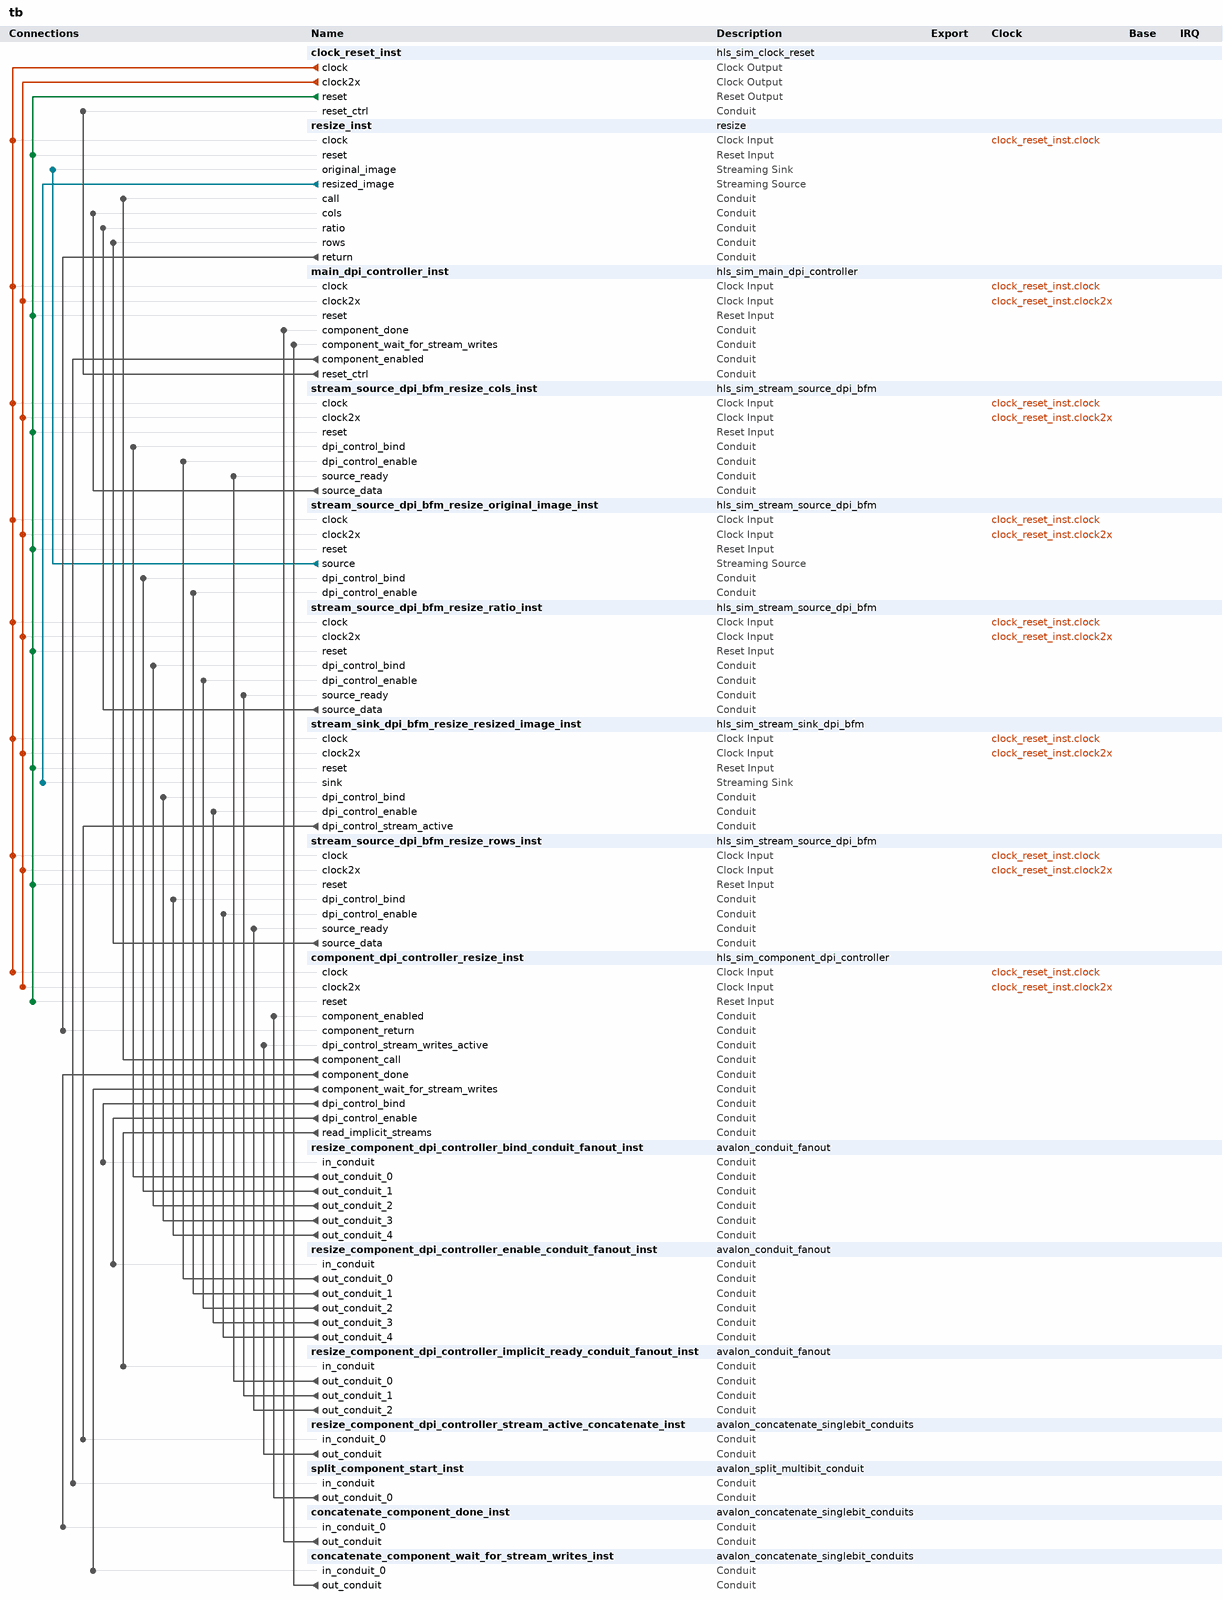
[diagram p0: system contents]
# Platform Designer (Qsys) system tb, Cyclone V 5CGXFC3B6F23C6
# Parameters at their usual value, and those the tool derives, are not listed.
package require qsys
create_system tb
set_project_property DEVICE_FAMILY {Cyclone V}
set_project_property DEVICE 5CGXFC3B6F23C6

add_instance clock_reset_inst hls_sim_clock_reset 1.0
set_instance_parameter_value clock_reset_inst RESET_CYCLE_HOLD 4

add_instance resize_inst resize 1.0

add_instance main_dpi_controller_inst hls_sim_main_dpi_controller 1.0
set_instance_parameter_value main_dpi_controller_inst COMPONENT_NAMES_STR resize
set_instance_parameter_value main_dpi_controller_inst NUM_COMPONENTS 1
set_instance_parameter_value main_dpi_controller_inst SIM_COMPONENT_CALL_COUNT_LOG_FILE .

add_instance stream_source_dpi_bfm_resize_cols_inst hls_sim_stream_source_dpi_bfm 1.0
set_instance_parameter_value stream_source_dpi_bfm_resize_cols_inst COMPONENT_NAME resize
set_instance_parameter_value stream_source_dpi_bfm_resize_cols_inst FORCE_STREAM_CONDUIT 1
set_instance_parameter_value stream_source_dpi_bfm_resize_cols_inst INTERFACE_NAME cols
set_instance_parameter_value stream_source_dpi_bfm_resize_cols_inst STREAM_BITSPERSYMBOL 1
set_instance_parameter_value stream_source_dpi_bfm_resize_cols_inst STREAM_DATAWIDTH 32
set_instance_parameter_value stream_source_dpi_bfm_resize_cols_inst USES_PACKETS 0

add_instance stream_source_dpi_bfm_resize_original_image_inst hls_sim_stream_source_dpi_bfm 1.0
set_instance_parameter_value stream_source_dpi_bfm_resize_original_image_inst COMPONENT_NAME resize
set_instance_parameter_value stream_source_dpi_bfm_resize_original_image_inst FORCE_STREAM_CONDUIT 0
set_instance_parameter_value stream_source_dpi_bfm_resize_original_image_inst INTERFACE_NAME original_image
set_instance_parameter_value stream_source_dpi_bfm_resize_original_image_inst STREAM_BITSPERSYMBOL 32
set_instance_parameter_value stream_source_dpi_bfm_resize_original_image_inst STREAM_DATAWIDTH 32
set_instance_parameter_value stream_source_dpi_bfm_resize_original_image_inst USES_PACKETS 0

add_instance stream_source_dpi_bfm_resize_ratio_inst hls_sim_stream_source_dpi_bfm 1.0
set_instance_parameter_value stream_source_dpi_bfm_resize_ratio_inst COMPONENT_NAME resize
set_instance_parameter_value stream_source_dpi_bfm_resize_ratio_inst FORCE_STREAM_CONDUIT 1
set_instance_parameter_value stream_source_dpi_bfm_resize_ratio_inst INTERFACE_NAME ratio
set_instance_parameter_value stream_source_dpi_bfm_resize_ratio_inst STREAM_BITSPERSYMBOL 1
set_instance_parameter_value stream_source_dpi_bfm_resize_ratio_inst STREAM_DATAWIDTH 32
set_instance_parameter_value stream_source_dpi_bfm_resize_ratio_inst USES_PACKETS 0

add_instance stream_sink_dpi_bfm_resize_resized_image_inst hls_sim_stream_sink_dpi_bfm 1.0
set_instance_parameter_value stream_sink_dpi_bfm_resize_resized_image_inst COMPONENT_NAME resize
set_instance_parameter_value stream_sink_dpi_bfm_resize_resized_image_inst INTERFACE_NAME resized_image
set_instance_parameter_value stream_sink_dpi_bfm_resize_resized_image_inst READY_LATENCY 0
set_instance_parameter_value stream_sink_dpi_bfm_resize_resized_image_inst STREAM_BITSPERSYMBOL 32
set_instance_parameter_value stream_sink_dpi_bfm_resize_resized_image_inst STREAM_DATAWIDTH 32
set_instance_parameter_value stream_sink_dpi_bfm_resize_resized_image_inst USES_PACKETS 0

add_instance stream_source_dpi_bfm_resize_rows_inst hls_sim_stream_source_dpi_bfm 1.0
set_instance_parameter_value stream_source_dpi_bfm_resize_rows_inst COMPONENT_NAME resize
set_instance_parameter_value stream_source_dpi_bfm_resize_rows_inst FORCE_STREAM_CONDUIT 1
set_instance_parameter_value stream_source_dpi_bfm_resize_rows_inst INTERFACE_NAME rows
set_instance_parameter_value stream_source_dpi_bfm_resize_rows_inst STREAM_BITSPERSYMBOL 1
set_instance_parameter_value stream_source_dpi_bfm_resize_rows_inst STREAM_DATAWIDTH 32
set_instance_parameter_value stream_source_dpi_bfm_resize_rows_inst USES_PACKETS 0

add_instance component_dpi_controller_resize_inst hls_sim_component_dpi_controller 1.0
set_instance_parameter_value component_dpi_controller_resize_inst COMPONENT_HAS_SLAVE_RETURN 0
set_instance_parameter_value component_dpi_controller_resize_inst COMPONENT_NAME resize
set_instance_parameter_value component_dpi_controller_resize_inst COMPONENT_NUM_OUTPUT_STREAMS 1
set_instance_parameter_value component_dpi_controller_resize_inst COMPONENT_NUM_SLAVES 0
set_instance_parameter_value component_dpi_controller_resize_inst RETURN_DATAWIDTH 64

add_instance resize_component_dpi_controller_bind_conduit_fanout_inst avalon_conduit_fanout 1.0
set_instance_parameter_value resize_component_dpi_controller_bind_conduit_fanout_inst numFanOut 5

add_instance resize_component_dpi_controller_enable_conduit_fanout_inst avalon_conduit_fanout 1.0
set_instance_parameter_value resize_component_dpi_controller_enable_conduit_fanout_inst numFanOut 5

add_instance resize_component_dpi_controller_implicit_ready_conduit_fanout_inst avalon_conduit_fanout 1.0
set_instance_parameter_value resize_component_dpi_controller_implicit_ready_conduit_fanout_inst numFanOut 3

add_instance resize_component_dpi_controller_stream_active_concatenate_inst avalon_concatenate_singlebit_conduits 1.0
set_instance_parameter_value resize_component_dpi_controller_stream_active_concatenate_inst multibit_width 1

add_instance split_component_start_inst avalon_split_multibit_conduit 1.0
set_instance_parameter_value split_component_start_inst multibit_width 1

add_instance concatenate_component_done_inst avalon_concatenate_singlebit_conduits 1.0
set_instance_parameter_value concatenate_component_done_inst multibit_width 1

add_instance concatenate_component_wait_for_stream_writes_inst avalon_concatenate_singlebit_conduits 1.0
set_instance_parameter_value concatenate_component_wait_for_stream_writes_inst multibit_width 1

# connections
add_connection clock_reset_inst.clock component_dpi_controller_resize_inst.clock clock
add_connection clock_reset_inst.clock main_dpi_controller_inst.clock clock
add_connection clock_reset_inst.clock resize_inst.clock clock
add_connection clock_reset_inst.clock stream_sink_dpi_bfm_resize_resized_image_inst.clock clock
add_connection clock_reset_inst.clock stream_source_dpi_bfm_resize_cols_inst.clock clock
add_connection clock_reset_inst.clock stream_source_dpi_bfm_resize_original_image_inst.clock clock
add_connection clock_reset_inst.clock stream_source_dpi_bfm_resize_ratio_inst.clock clock
add_connection clock_reset_inst.clock stream_source_dpi_bfm_resize_rows_inst.clock clock
add_connection clock_reset_inst.clock2x component_dpi_controller_resize_inst.clock2x clock
add_connection clock_reset_inst.clock2x main_dpi_controller_inst.clock2x clock
add_connection clock_reset_inst.clock2x stream_sink_dpi_bfm_resize_resized_image_inst.clock2x clock
add_connection clock_reset_inst.clock2x stream_source_dpi_bfm_resize_cols_inst.clock2x clock
add_connection clock_reset_inst.clock2x stream_source_dpi_bfm_resize_original_image_inst.clock2x clock
add_connection clock_reset_inst.clock2x stream_source_dpi_bfm_resize_ratio_inst.clock2x clock
add_connection clock_reset_inst.clock2x stream_source_dpi_bfm_resize_rows_inst.clock2x clock
add_connection clock_reset_inst.reset component_dpi_controller_resize_inst.reset reset
add_connection clock_reset_inst.reset main_dpi_controller_inst.reset reset
add_connection clock_reset_inst.reset resize_inst.reset reset
add_connection clock_reset_inst.reset stream_sink_dpi_bfm_resize_resized_image_inst.reset reset
add_connection clock_reset_inst.reset stream_source_dpi_bfm_resize_cols_inst.reset reset
add_connection clock_reset_inst.reset stream_source_dpi_bfm_resize_original_image_inst.reset reset
add_connection clock_reset_inst.reset stream_source_dpi_bfm_resize_ratio_inst.reset reset
add_connection clock_reset_inst.reset stream_source_dpi_bfm_resize_rows_inst.reset reset
add_connection resize_inst.resized_image stream_sink_dpi_bfm_resize_resized_image_inst.sink avalon_streaming
add_connection stream_source_dpi_bfm_resize_original_image_inst.source resize_inst.original_image avalon_streaming
add_connection component_dpi_controller_resize_inst.component_call resize_inst.call conduit
add_connection component_dpi_controller_resize_inst.component_done concatenate_component_done_inst.in_conduit_0 conduit
add_connection component_dpi_controller_resize_inst.component_wait_for_stream_writes concatenate_component_wait_for_stream_writes_inst.in_conduit_0 conduit
add_connection component_dpi_controller_resize_inst.dpi_control_bind resize_component_dpi_controller_bind_conduit_fanout_inst.in_conduit conduit
add_connection component_dpi_controller_resize_inst.dpi_control_enable resize_component_dpi_controller_enable_conduit_fanout_inst.in_conduit conduit
add_connection component_dpi_controller_resize_inst.read_implicit_streams resize_component_dpi_controller_implicit_ready_conduit_fanout_inst.in_conduit conduit
add_connection concatenate_component_done_inst.out_conduit main_dpi_controller_inst.component_done conduit
add_connection concatenate_component_wait_for_stream_writes_inst.out_conduit main_dpi_controller_inst.component_wait_for_stream_writes conduit
add_connection main_dpi_controller_inst.component_enabled split_component_start_inst.in_conduit conduit
add_connection main_dpi_controller_inst.reset_ctrl clock_reset_inst.reset_ctrl conduit
add_connection resize_component_dpi_controller_bind_conduit_fanout_inst.out_conduit_0 stream_source_dpi_bfm_resize_cols_inst.dpi_control_bind conduit
add_connection resize_component_dpi_controller_bind_conduit_fanout_inst.out_conduit_1 stream_source_dpi_bfm_resize_original_image_inst.dpi_control_bind conduit
add_connection resize_component_dpi_controller_bind_conduit_fanout_inst.out_conduit_2 stream_source_dpi_bfm_resize_ratio_inst.dpi_control_bind conduit
add_connection resize_component_dpi_controller_bind_conduit_fanout_inst.out_conduit_3 stream_sink_dpi_bfm_resize_resized_image_inst.dpi_control_bind conduit
add_connection resize_component_dpi_controller_bind_conduit_fanout_inst.out_conduit_4 stream_source_dpi_bfm_resize_rows_inst.dpi_control_bind conduit
add_connection resize_component_dpi_controller_enable_conduit_fanout_inst.out_conduit_0 stream_source_dpi_bfm_resize_cols_inst.dpi_control_enable conduit
add_connection resize_component_dpi_controller_enable_conduit_fanout_inst.out_conduit_1 stream_source_dpi_bfm_resize_original_image_inst.dpi_control_enable conduit
add_connection resize_component_dpi_controller_enable_conduit_fanout_inst.out_conduit_2 stream_source_dpi_bfm_resize_ratio_inst.dpi_control_enable conduit
add_connection resize_component_dpi_controller_enable_conduit_fanout_inst.out_conduit_3 stream_sink_dpi_bfm_resize_resized_image_inst.dpi_control_enable conduit
add_connection resize_component_dpi_controller_enable_conduit_fanout_inst.out_conduit_4 stream_source_dpi_bfm_resize_rows_inst.dpi_control_enable conduit
add_connection resize_component_dpi_controller_implicit_ready_conduit_fanout_inst.out_conduit_0 stream_source_dpi_bfm_resize_cols_inst.source_ready conduit
add_connection resize_component_dpi_controller_implicit_ready_conduit_fanout_inst.out_conduit_1 stream_source_dpi_bfm_resize_ratio_inst.source_ready conduit
add_connection resize_component_dpi_controller_implicit_ready_conduit_fanout_inst.out_conduit_2 stream_source_dpi_bfm_resize_rows_inst.source_ready conduit
add_connection resize_component_dpi_controller_stream_active_concatenate_inst.out_conduit component_dpi_controller_resize_inst.dpi_control_stream_writes_active conduit
add_connection resize_inst.return component_dpi_controller_resize_inst.component_return conduit
add_connection split_component_start_inst.out_conduit_0 component_dpi_controller_resize_inst.component_enabled conduit
add_connection stream_sink_dpi_bfm_resize_resized_image_inst.dpi_control_stream_active resize_component_dpi_controller_stream_active_concatenate_inst.in_conduit_0 conduit
add_connection stream_source_dpi_bfm_resize_cols_inst.source_data resize_inst.cols conduit
add_connection stream_source_dpi_bfm_resize_ratio_inst.source_data resize_inst.ratio conduit
add_connection stream_source_dpi_bfm_resize_rows_inst.source_data resize_inst.rows conduit

set_interconnect_requirement {$system} qsys_mm.clockCrossingAdapter HANDSHAKE
set_interconnect_requirement {$system} qsys_mm.enableEccProtection FALSE
set_interconnect_requirement {$system} qsys_mm.insertDefaultSlave FALSE
set_interconnect_requirement {$system} qsys_mm.maxAdditionalLatency 1

save_system tb.qsys
